# Altium schematic sheet AVR.SchDoc: Gyroscopes Buffer
size A3; CheckedBy: (not checked); Author: P. Kuligowski
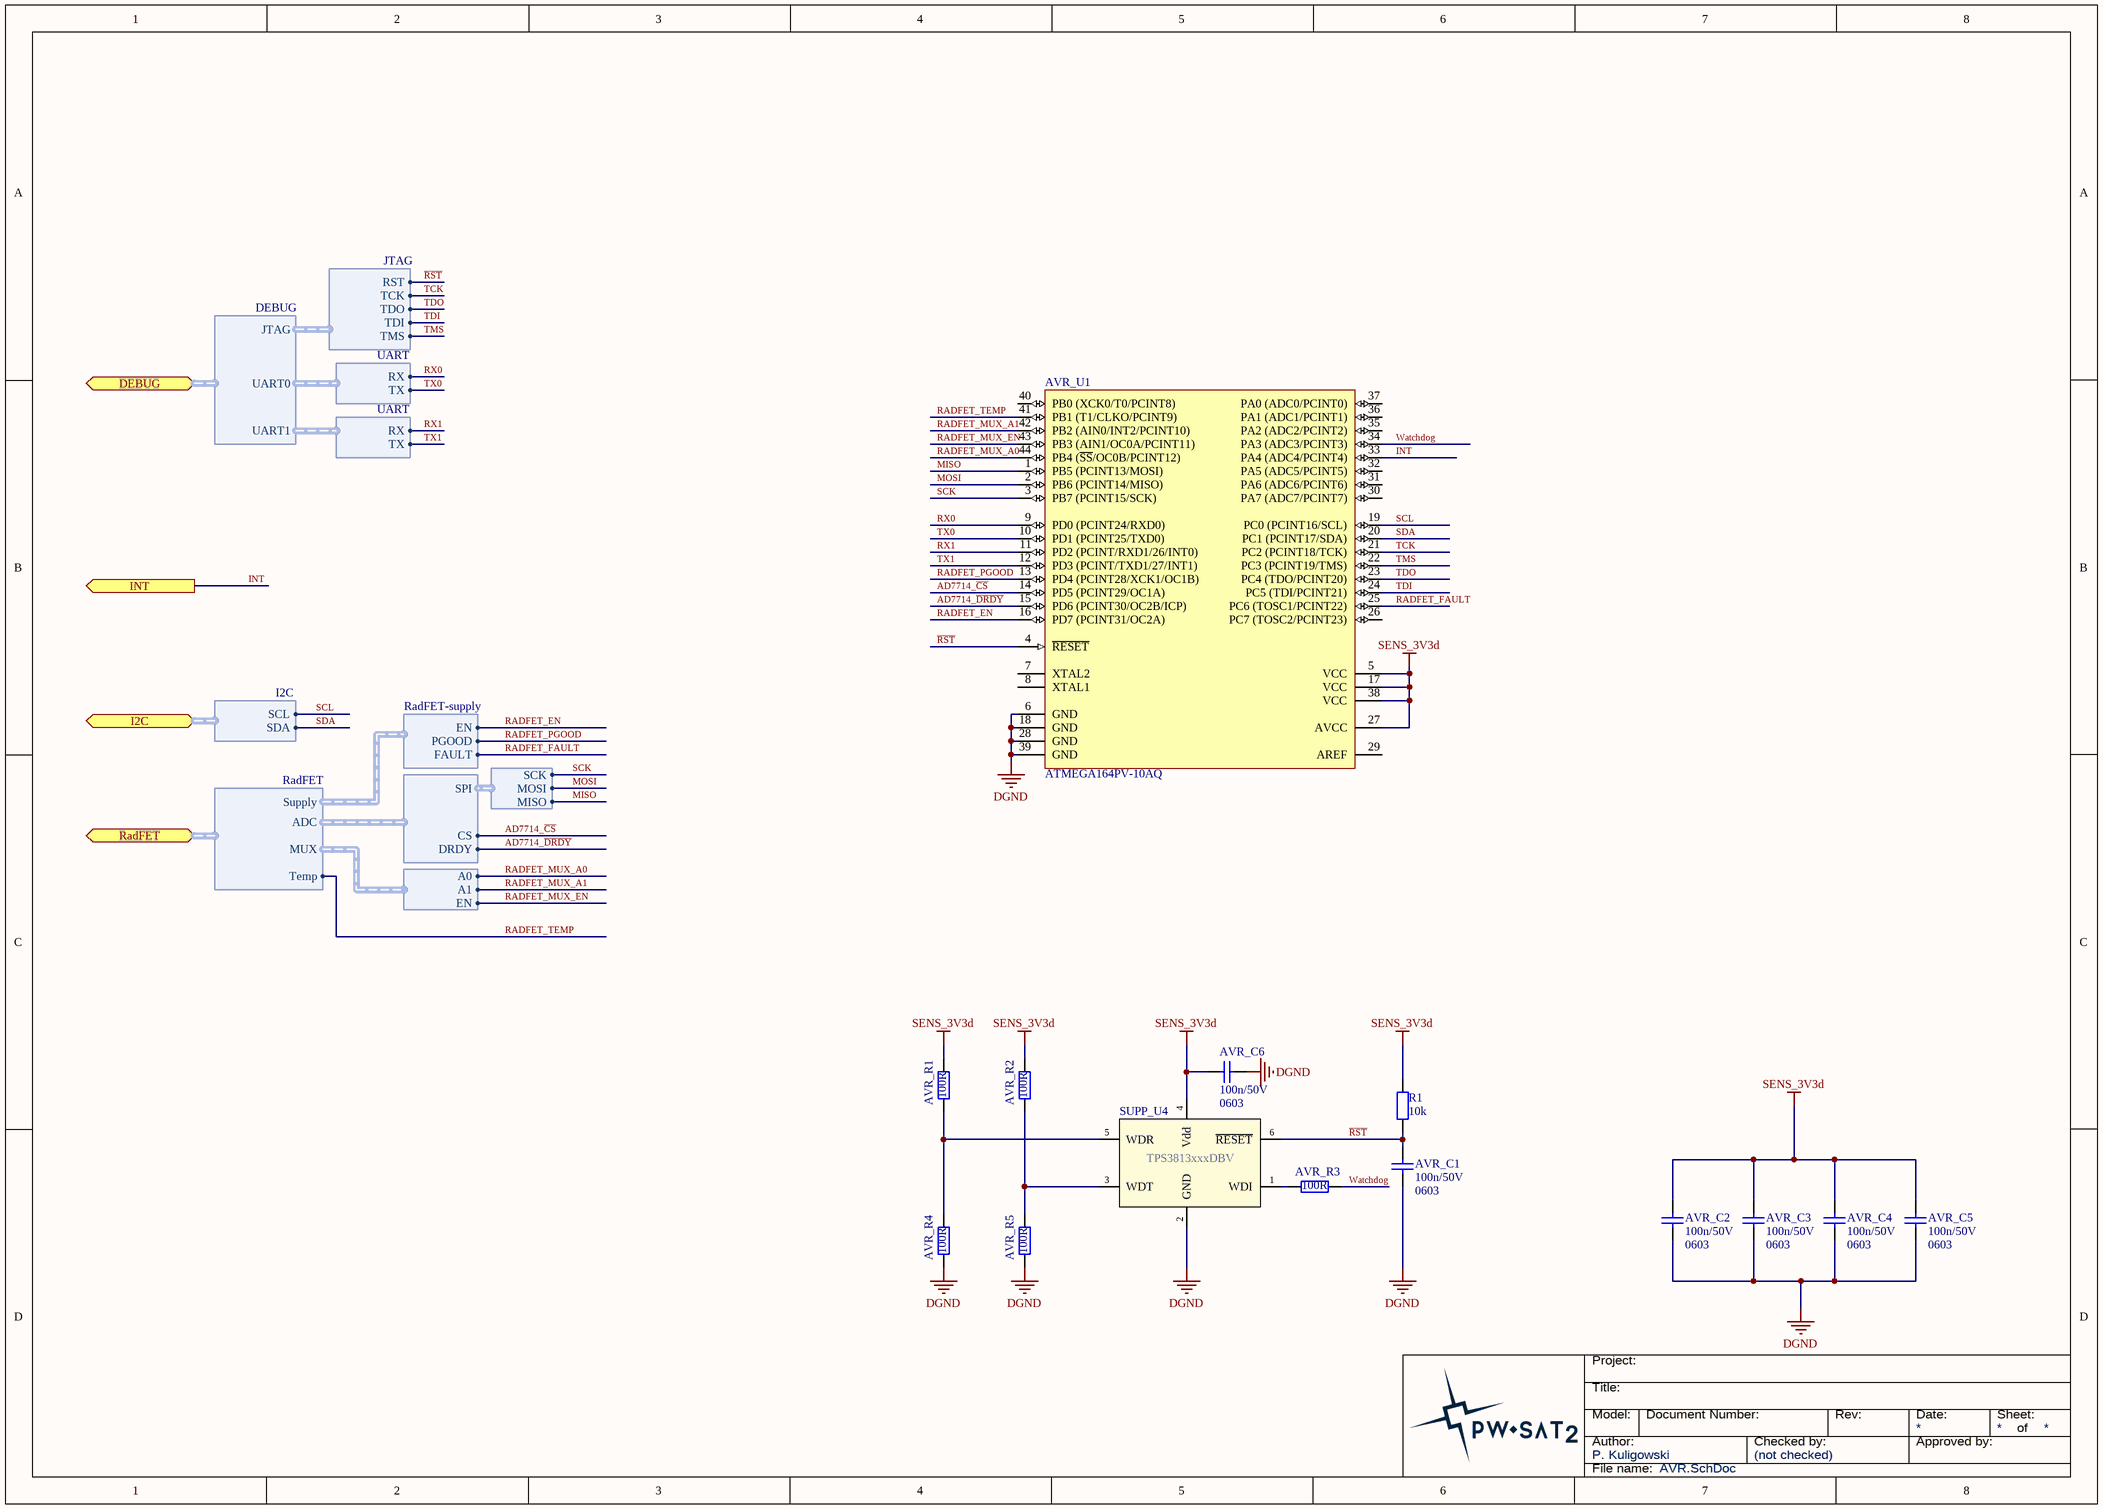
[diagram p0: AVR.SchDoc]

## Parts
AVR_C1  Package: 0603  [SMD_Capacitor_0603]  (hidden comment: 100n/50V)
AVR_C2  Package: 0603  [SMD_Capacitor_0603]  (hidden comment: 100n/50V)
AVR_C3  Package: 0603  [SMD_Capacitor_0603]  (hidden comment: 100n/50V)
AVR_C4  Package: 0603  [SMD_Capacitor_0603]  (hidden comment: 100n/50V)
AVR_C5  Package: 0603  [SMD_Capacitor_0603]  (hidden comment: 100n/50V)
AVR_C6  Package: 0603  [SMD_Capacitor_0603]  (hidden comment: 100n/50V)
AVR_R1  100R  [SMD_Resistor_0603]
AVR_R2  100R  [SMD_Resistor_0603]
AVR_R3  100R  [SMD_Resistor_0603]
AVR_R4  100R  [SMD_Resistor_0603]
AVR_R5  100R  [SMD_Resistor_0603]
AVR_U1  ATMEGA164PV-10AQ  [TQFP-44]
R1  10k  [SMD_Resistor_0603]
SUPP_U4  TPS3813xxxDBV  [SOT23-6]

## Ports
DEBUG (harness DEBUG), I2C (harness I2C), INT (out), RadFET (harness RadFET)

## Harnesses
ADC_DIGITAL: DRDY, CS, SPI
ADG709_MUX: A0, A1, EN
SPI: SCK, MOSI, MISO
I2C: SDA, SCL
DEBUG: JTAG, UART0, UART1
JTAG: RST, TCK, TDO, TDI, TMS
UART: RX, TX
RadFET-supply: EN, PGOOD, FAULT
RadFET: ADC, MUX, Supply, Temp

## Nets
DGND: AVR_C1.2 AVR_C2.2 AVR_C3.2 AVR_C4.2 AVR_C5.2 AVR_C6.2 AVR_R4.2 AVR_R5.2 AVR_U1.6(GND) AVR_U1.18(GND) AVR_U1.28(GND) AVR_U1.39(GND) SUPP_U4.2(GND)
SENS_3V3d: AVR_C2.1 AVR_C3.1 AVR_C4.1 AVR_C5.1 AVR_C6.1 AVR_R1.1 AVR_R2.1 AVR_U1.5(VCC) AVR_U1.17(VCC) AVR_U1.27(AVCC) AVR_U1.38(VCC) R1.1 SUPP_U4.4(Vdd)
AD7714_~{CS}: AVR_U1.14(PD5_(PCINT29/OC1A)) ; harness ADC_DIGITAL.CS
AD7714_~{DRDY}: AVR_U1.15(PD6_(PCINT30/OC2B/ICP)) ; harness ADC_DIGITAL.DRDY
INT: AVR_U1.33(PA4_(ADC4/PCINT4)) ; port INT
MISO: AVR_U1.1(PB5_(PCINT13/MOSI)) ; harness SPI.MISO
MOSI: AVR_U1.2(PB6_(PCINT14/MISO)) ; harness SPI.MOSI
~{RST}: AVR_C1.1 AVR_U1.4(~{RESET}) R1.2 SUPP_U4.6(~{RESET}) ; harness JTAG.RST
RADFET_EN: AVR_U1.16(PD7_(PCINT31/OC2A)) ; harness RadFET-supply.EN
RADFET_FAULT: AVR_U1.25(PC6_(TOSC1/PCINT22)) ; harness RadFET-supply.FAULT
RADFET_MUX_A0: AVR_U1.44(PB4_(~{SS}/OC0B/PCINT12)) ; harness ADG709_MUX.A0
RADFET_MUX_A1: AVR_U1.42(PB2_(AIN0/INT2/PCINT10)) ; harness ADG709_MUX.A1
RADFET_MUX_EN: AVR_U1.43(PB3_(AIN1/OC0A/PCINT11)) ; harness ADG709_MUX.EN
RADFET_PGOOD: AVR_U1.13(PD4_(PCINT28/XCK1/OC1B)) ; harness RadFET-supply.PGOOD
RADFET_TEMP: AVR_U1.41(PB1_(T1/CLKO/PCINT9)) ; port RadFET.Temp
RX0: AVR_U1.9(PD0_(PCINT24/RXD0)) ; harness UART.RX
RX1: AVR_U1.11(PD2_(PCINT/RXD1/26/INT0)) ; harness UART.RX
SCK: AVR_U1.3(PB7_(PCINT15/SCK)) ; harness SPI.SCK
SCL: AVR_U1.19(PC0_(PCINT16/SCL)) ; port I2C.SCL
SDA: AVR_U1.20(PC1_(PCINT17/SDA)) ; port I2C.SDA
TCK: AVR_U1.21(PC2_(PCINT18/TCK)) ; harness JTAG.TCK
TDI: AVR_U1.24(PC5_(TDI/PCINT21)) ; harness JTAG.TDI
TDO: AVR_U1.23(PC4_(TDO/PCINT20)) ; harness JTAG.TDO
TMS: AVR_U1.22(PC3_(PCINT19/TMS)) ; harness JTAG.TMS
TX0: AVR_U1.10(PD1_(PCINT25/TXD0)) ; harness UART.TX
TX1: AVR_U1.12(PD3_(PCINT/TXD1/27/INT1)) ; harness UART.TX
Watchdog: AVR_R3.2 AVR_U1.34(PA3_(ADC3/PCINT3))
NetAVR_R1_2: AVR_R1.2 AVR_R4.1 SUPP_U4.5(WDR)
NetAVR_R2_2: AVR_R2.2 AVR_R5.1 SUPP_U4.3(WDT)
NetAVR_R3_1: AVR_R3.1 SUPP_U4.1(WDI)

Not connected (* = marked no-connect by the designer): AVR_U1 7(XTAL2) 8(XTAL1) 26(PC7_(TOSC2/PCINT23)) 29(AREF) 30(PA7_(ADC7/PCINT7)) 31(PA6_(ADC6/PCINT6)) 32(PA5_(ADC5/PCINT5)) 35(PA2_(ADC2/PCINT2)) 36(PA1_(ADC1/PCINT1)) 37(PA0_(ADC0/PCINT0)) 40(PB0_(XCK0/T0/PCINT8))

## Notes on the sheet
- Title:
- Project:
- Author:
- Model:
- Document Number:
- Checked by:
- Rev:
- Date:
- Approved by:
- Sheet:
- of
- File name:

## Library data of the parts
AVR_C1-AVR_C6 = Cer_C0603T104K5RALTU: Ceramic Cap Kemet COTS 100n/50V X7R 0603; Manufacturer: Kemet; ManufacturerPartNumber: C0603T104K5RALTU; Value: 100n/50V
AVR_R1-AVR_R5 = Res: Value: 100R; Package: 0603
AVR_U1 = ATMEGA164PV-10AQ: General-purpose microcontroller; Value: ATMEGA164PV-10AQ
R1 = CRCW060310K0FKxxxx: 10k/1% Vishay CRCW 0603 Resistor. 100mW, 100ppm, 75V.; Manufacturer: Vishay; ManufacturerPartNumber: CRCW060310K0FKxxxx; Value: 10k; Package: 0603
SUPP_U4 = TPS3813xxxDBV: Processor Supervisory Circuits with Window-Watchdog.; Manufacturer: Texas Instruments; Value: TPS3813xxxDBV